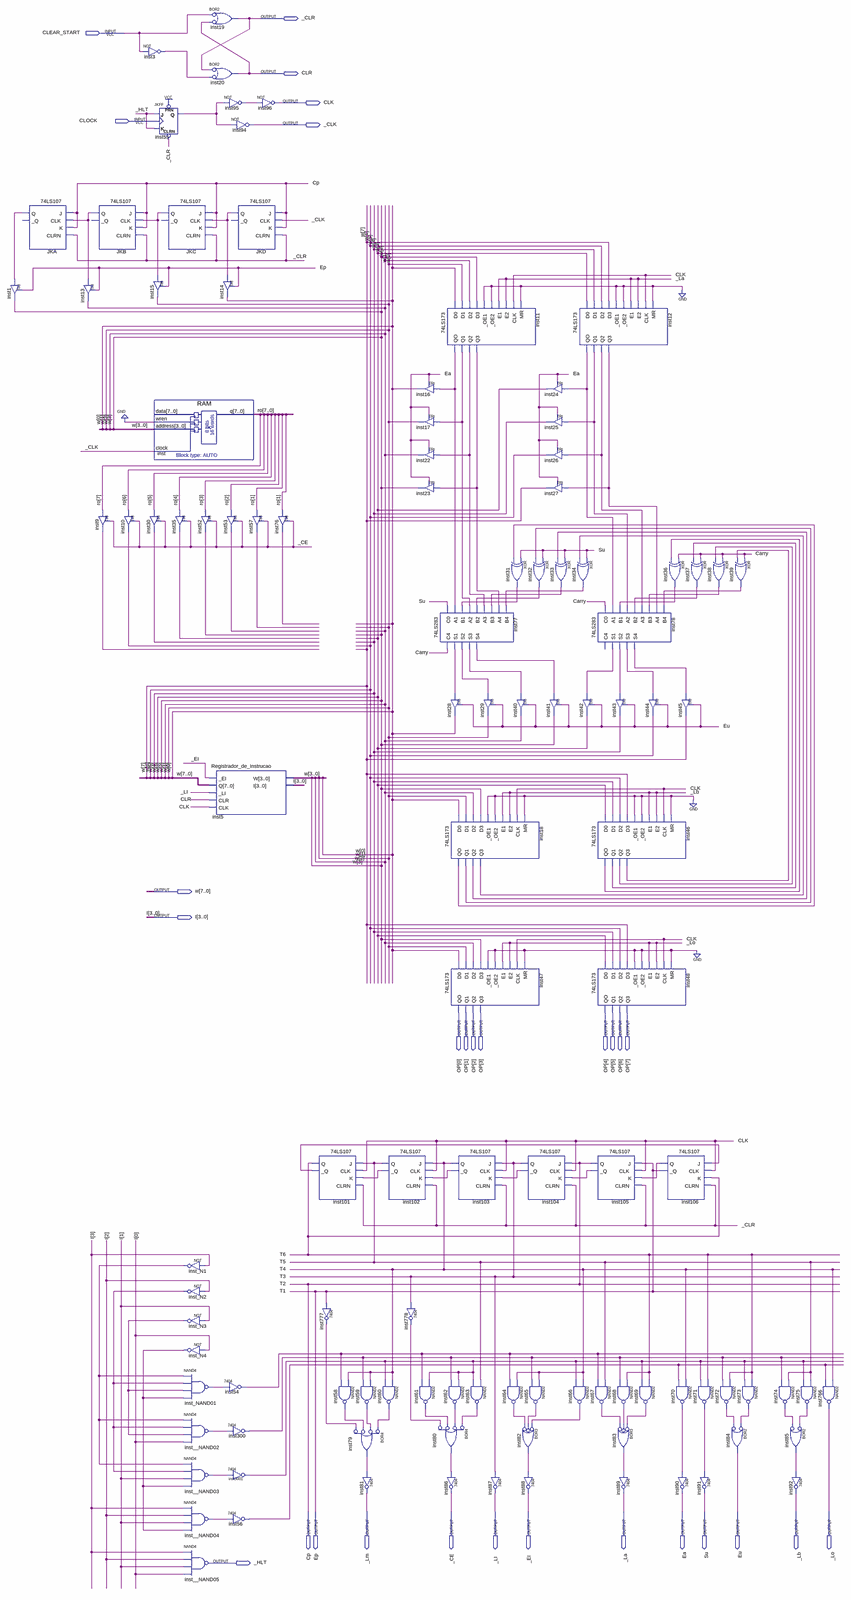
[diagram p0: schematic sheet, whole]
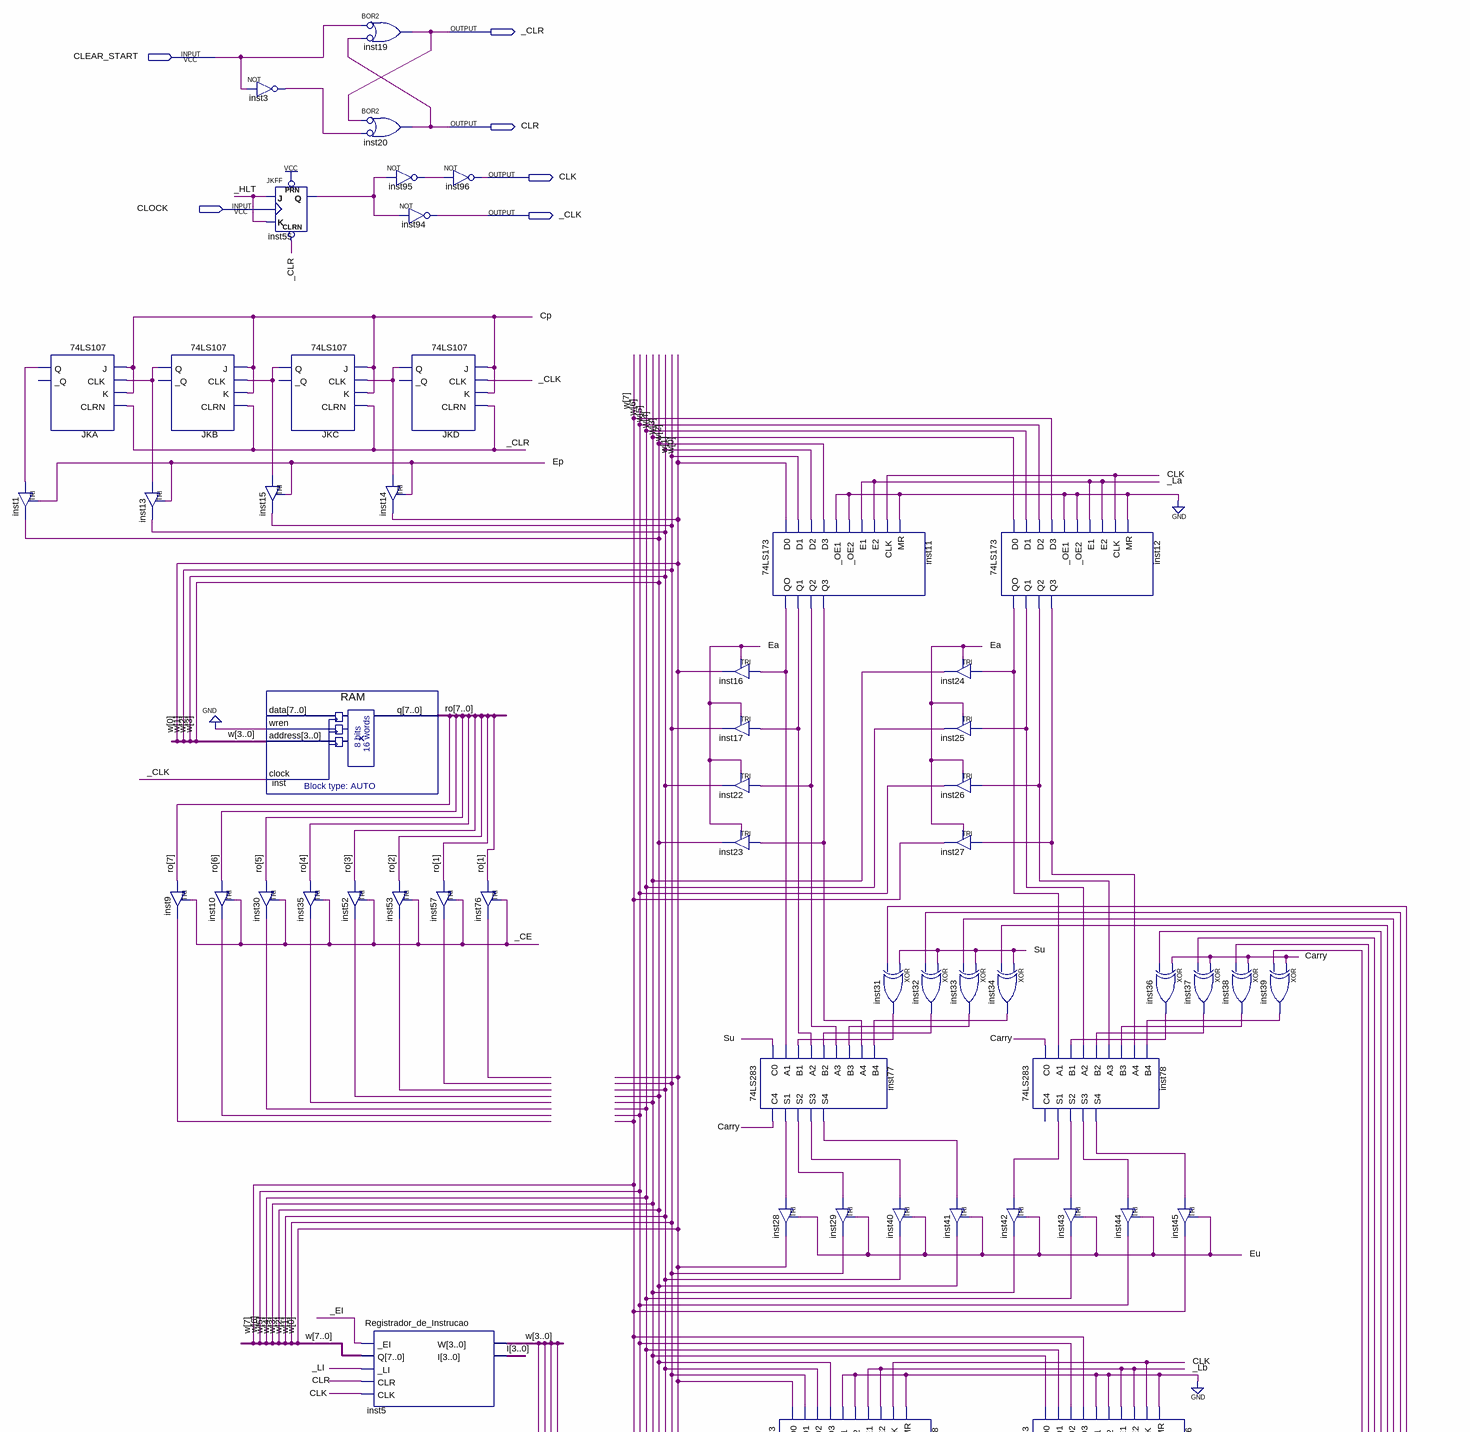
[diagram p1: schematic sheet, upper part]
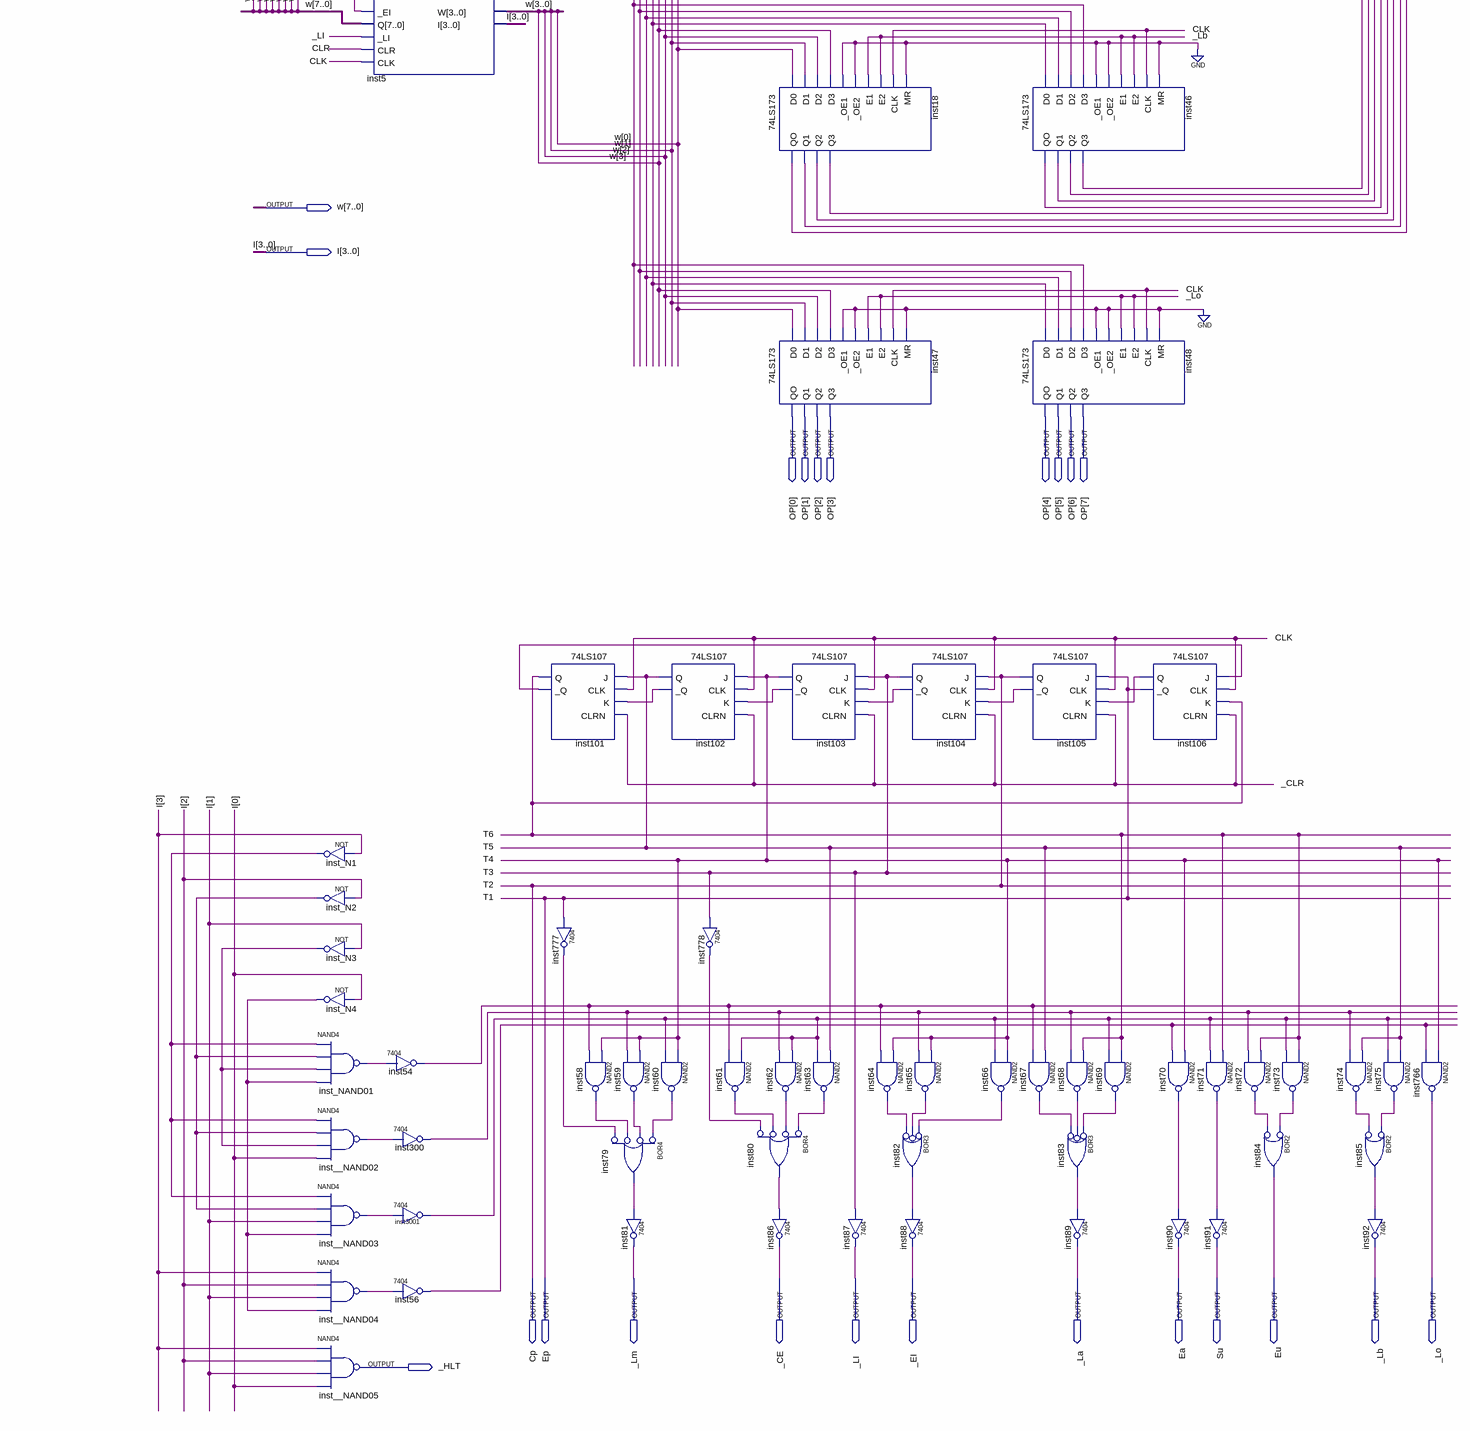
[diagram p2: schematic sheet, lower part]
// Quartus schematic SAP1.bdf as structural Verilog: 111 symbols, 29 pins
module SAP1 (
  input  CLEAR_START,
  input  CLOCK,
  output _CLR,
  output CLR,
  output CLK,
  output _CLK,
  output [7:0] w,
  output [3:0] I,
  output [7:0] OP,
  output Cp,
  output Ep,
  output _Lm,
  output _CE,
  output _LI,
  output _EI,
  output _La,
  output Ea,
  output Su,
  output Eu,
  output _Lb,
  output _Lo,
  output _HLT
);

  wire Carry, inst3_out, inst9_out, inst10_out, inst11_q1, inst11_q2, inst11_q3, inst11_qo, inst12_q1,
       inst12_q2, inst12_q3, inst12_qo, inst18_q1, inst18_q2, inst18_q3, inst18_qo, inst30_out, inst31_out,
       inst32_out, inst33_out, inst34_out, inst35_out, inst36_out, inst37_out, inst38_out, inst39_out,
       inst46_q1, inst46_q2, inst46_q3, inst46_qo, inst52_out, inst53_out, inst54_1, inst55_q, inst56_1,
       inst57_out, inst58_out, inst59_out, inst60_out, inst61_out, inst62_out, inst63_out, inst64_out,
       inst65_out, inst66_out, inst67_out, inst68_out, inst69_out, inst70_out, inst71_out, inst72_out,
       inst73_out, inst74_out, inst75_out, inst76_out, inst77_s1, inst77_s2, inst77_s3, inst77_s4, inst78_s1,
       inst78_s2, inst78_s3, inst78_s4, inst79_out, inst80_out, inst82_out, inst83_out, inst85_out,
       inst95_out, inst101__q, inst102__q, inst103__q, inst104__q, inst105__q, inst106_q, inst300_1,
       inst777_1, inst778_1, inst3001_1, inst__NAND02_out, inst__NAND03_out, inst__NAND04_out, inst_N1_out,
       inst_N2_out, inst_N3_out, inst_N4_out, inst_NAND01_out, JKA_q, JKB_q, JKC_q, JKD_q, T3, T4, T5, T6;
  wire [7:0] ro;

  \74LS107  JKA (.J(Cp), .CLK(JKB_q), .K(Cp), .CLRN(_CLR), .Q(JKA_q));  // open: _Q
  TRI inst1 (.IN(JKA_q), .OE(Ep), .OUT(w[3]));
  \74LS107  JKB (.J(Cp), .CLK(JKC_q), .K(Cp), .CLRN(_CLR), .Q(JKB_q));  // open: _Q
  TRI inst13 (.IN(JKB_q), .OE(Ep), .OUT(w[2]));
  TRI inst9 (.IN(ro[7]), .OE(_CE), .OUT(inst9_out));
  TRI inst10 (.IN(ro[6]), .OE(_CE), .OUT(inst10_out));
  not inst3 (inst3_out, CLEAR_START);
  TRI inst15 (.IN(JKC_q), .OE(Ep), .OUT(w[1]));
  TRI inst30 (.IN(ro[5]), .OE(_CE), .OUT(inst30_out));
  JKFF inst55 (.PRN(1'b1), .CLRN(_CLR), .K(_HLT), .J(_HLT), .CLK(CLOCK), .Q(inst55_q));
  \74LS107  JKC (.J(Cp), .CLK(JKD_q), .K(Cp), .CLRN(_CLR), .Q(JKC_q));  // open: _Q
  RAM inst (.wren(1'b0), .address(w[3:0]), .clock(_CLK), .q(ro));  // open: data
  TRI inst35 (.IN(ro[4]), .OE(_CE), .OUT(inst35_out));
  or inst19 (_CLR, ~CLEAR_START, ~CLR);  // BOR2
  or inst20 (CLR, ~_CLR, ~inst3_out);  // BOR2
  TRI inst52 (.IN(ro[3]), .OE(_CE), .OUT(inst52_out));
  Registrador_de_Instrucao inst5 (._EI(_EI), .Q(w), ._LI(_LI), .CLR(CLR), .CLK(CLK), .W(w[3:0]), .I(I));
  not inst_N1 (inst_N1_out, I[3]);
  not inst_N2 (inst_N2_out, I[2]);
  not inst_N3 (inst_N3_out, I[1]);
  not inst_N4 (inst_N4_out, I[0]);
  nand inst_NAND01 (inst_NAND01_out, inst_N1_out, inst_N2_out, inst_N3_out, inst_N4_out);
  nand inst__NAND02 (inst__NAND02_out, inst_N1_out, inst_N2_out, inst_N3_out, I[0]);
  nand inst__NAND03 (inst__NAND03_out, inst_N1_out, inst_N2_out, I[1], inst_N4_out);
  nand inst__NAND04 (inst__NAND04_out, I[3], I[2], I[1], inst_N4_out);
  nand inst__NAND05 (_HLT, I[3], I[2], I[1], I[0]);
  not inst95 (inst95_out, inst55_q);
  not inst94 (_CLK, inst55_q);
  \74LS107  JKD (.J(Cp), .CLK(_CLK), .K(Cp), .CLRN(_CLR), .Q(JKD_q));  // open: _Q
  TRI inst14 (.IN(JKD_q), .OE(Ep), .OUT(w[0]));
  TRI inst53 (.IN(ro[2]), .OE(_CE), .OUT(inst53_out));
  \7404  inst54 (.\2 (inst_NAND01_out), .\1 (inst54_1));
  \7404  inst300 (.\2 (inst__NAND02_out), .\1 (inst300_1));
  \7404  inst3001 (.\2 (inst__NAND03_out), .\1 (inst3001_1));
  \7404  inst56 (.\2 (inst__NAND04_out), .\1 (inst56_1));
  not inst96 (CLK, inst95_out);
  TRI inst57 (.IN(ro[1]), .OE(_CE), .OUT(inst57_out));
  TRI inst76 (.IN(ro[1]), .OE(_CE), .OUT(inst76_out));
  \74LS107  inst101 (.J(T5), .CLK(CLK), .K(inst102__q), .CLRN(_CLR), .Q(T6), ._Q(inst101__q));
  \7404  inst777 (.\2 (Ep), .\1 (inst777_1));
  nand inst58 (inst58_out, T4, inst54_1);
  nand inst59 (inst59_out, T4, inst300_1);
  or inst79 (inst79_out, ~inst60_out, ~inst59_out, ~inst58_out, ~inst777_1);  // BOR4
  \74LS107  inst102 (.J(T4), .CLK(CLK), .K(inst103__q), .CLRN(_CLR), .Q(T5), ._Q(inst102__q));
  nand inst60 (inst60_out, T4, inst3001_1);
  \7404  inst81 (.\2 (inst79_out), .\1 (_Lm));
  \7404  inst778 (.\2 (T3), .\1 (inst778_1));
  nand inst61 (inst61_out, inst3001_1, inst54_1);
  \74LS173  inst11 (
    .D0(w[0]), .D1(w[1]), .D2(w[2]), .D3(w[3]), ._OE1(1'b0), ._OE2(1'b0), .E1(_La), .E2(_La), .CLK(CLK),
    .MR(1'b0), .QO(inst11_qo), .Q1(inst11_q1), .Q2(inst11_q2), .Q3(inst11_q3));
  TRI inst16 (.IN(inst11_qo), .OE(Ea), .OUT(w[0]));
  TRI inst17 (.IN(inst11_q1), .OE(Ea), .OUT(w[1]));
  TRI inst22 (.IN(inst11_q2), .OE(Ea), .OUT(w[2]));
  TRI inst23 (.IN(inst11_q3), .OE(Ea), .OUT(w[3]));
  \74LS283  inst77 (
    .C0(Su), .A1(inst11_qo), .B1(inst31_out), .A2(inst11_q1), .B2(inst32_out), .A3(inst11_q2),
    .B3(inst33_out), .A4(inst11_q3), .B4(inst34_out), .C4(Carry), .S1(inst77_s1), .S2(inst77_s2),
    .S3(inst77_s3), .S4(inst77_s4));
  \74LS173  inst18 (
    .D0(w[0]), .D1(w[1]), .D2(w[2]), .D3(w[3]), ._OE1(1'b0), ._OE2(1'b0), .E1(_Lb), .E2(_Lb), .CLK(CLK),
    .MR(1'b0), .QO(inst18_qo), .Q1(inst18_q1), .Q2(inst18_q2), .Q3(inst18_q3));
  \74LS173  inst47 (
    .D0(w[0]), .D1(w[1]), .D2(w[2]), .D3(w[3]), ._OE1(1'b0), ._OE2(1'b0), .E1(_Lo), .E2(_Lo), .CLK(CLK),
    .MR(1'b0), .QO(OP[0]), .Q1(OP[1]), .Q2(OP[2]), .Q3(OP[3]));
  nand inst62 (inst62_out, inst3001_1, inst300_1);
  or inst80 (inst80_out, ~inst63_out, ~inst62_out, ~inst61_out, ~inst778_1);  // BOR4
  \7404  inst86 (.\2 (inst80_out), .\1 (_CE));
  TRI inst28 (.IN(inst77_s1), .OE(Eu), .OUT(w[0]));
  \74LS107  inst103 (.J(T3), .CLK(CLK), .K(inst104__q), .CLRN(_CLR), .Q(T4), ._Q(inst103__q));
  nand inst63 (inst63_out, T5, inst3001_1);
  TRI inst29 (.IN(inst77_s2), .OE(Eu), .OUT(w[1]));
  nand inst64 (inst64_out, T4, inst54_1);
  \7404  inst87 (.\2 (T3), .\1 (_LI));
  xor inst31 (inst31_out, Su, inst18_qo);
  xor inst32 (inst32_out, Su, inst18_q1);
  TRI inst40 (.IN(inst77_s3), .OE(Eu), .OUT(w[2]));
  \74LS107  inst104 (.J(Cp), .CLK(CLK), .K(inst105__q), .CLRN(_CLR), .Q(T3), ._Q(inst104__q));
  nand inst65 (inst65_out, T4, inst300_1);
  or inst82 (inst82_out, ~inst66_out, ~inst65_out, ~inst64_out);  // BOR3
  \7404  inst88 (.\2 (inst82_out), .\1 (_EI));
  TRI inst24 (.IN(inst12_qo), .OE(Ea), .OUT(w[4]));
  TRI inst25 (.IN(inst12_q1), .OE(Ea), .OUT(w[5]));
  TRI inst26 (.IN(inst12_q2), .OE(Ea), .OUT(w[6]));
  TRI inst27 (.IN(inst12_q3), .OE(Ea), .OUT(w[7]));
  xor inst33 (inst33_out, Su, inst18_q2);
  TRI inst41 (.IN(inst77_s4), .OE(Eu), .OUT(w[3]));
  \74LS173  inst12 (
    .D0(w[4]), .D1(w[5]), .D2(w[6]), .D3(w[7]), ._OE1(1'b0), ._OE2(1'b0), .E1(_La), .E2(_La), .CLK(CLK),
    .MR(1'b0), .QO(inst12_qo), .Q1(inst12_q1), .Q2(inst12_q2), .Q3(inst12_q3));
  xor inst34 (inst34_out, Su, inst18_q3);
  \74LS283  inst78 (
    .C0(Carry), .A1(inst12_qo), .B1(inst36_out), .A2(inst12_q1), .B2(inst37_out), .A3(inst12_q2),
    .B3(inst38_out), .A4(inst12_q3), .B4(inst39_out), .S1(inst78_s1), .S2(inst78_s2), .S3(inst78_s3),
    .S4(inst78_s4));  // open: C4
  TRI inst42 (.IN(inst78_s1), .OE(Eu), .OUT(w[4]));
  \74LS173  inst46 (
    .D0(w[4]), .D1(w[5]), .D2(w[6]), .D3(w[7]), ._OE1(1'b0), ._OE2(1'b0), .E1(_Lb), .E2(_Lb), .CLK(CLK),
    .MR(1'b0), .QO(inst46_qo), .Q1(inst46_q1), .Q2(inst46_q2), .Q3(inst46_q3));
  \74LS173  inst48 (
    .D0(w[4]), .D1(w[5]), .D2(w[6]), .D3(w[7]), ._OE1(1'b0), ._OE2(1'b0), .E1(_Lo), .E2(_Lo), .CLK(CLK),
    .MR(1'b0), .QO(OP[4]), .Q1(OP[5]), .Q2(OP[6]), .Q3(OP[7]));
  \74LS107  inst105 (.J(Ep), .CLK(CLK), .K(inst106_q), .CLRN(_CLR), .Q(Cp), ._Q(inst105__q));
  nand inst66 (inst66_out, T4, inst3001_1);
  nand inst67 (inst67_out, T5, inst54_1);
  TRI inst43 (.IN(inst78_s2), .OE(Eu), .OUT(w[5]));
  nand inst68 (inst68_out, T6, inst300_1);
  or inst83 (inst83_out, ~inst69_out, ~inst68_out, ~inst67_out);  // BOR3
  \7404  inst89 (.\2 (inst83_out), .\1 (_La));
  TRI inst44 (.IN(inst78_s3), .OE(Eu), .OUT(w[6]));
  nand inst69 (inst69_out, T6, inst3001_1);
  xor inst36 (inst36_out, Carry, inst46_qo);
  TRI inst45 (.IN(inst78_s4), .OE(Eu), .OUT(w[7]));
  \74LS107  inst106 (.J(inst101__q), .CLK(CLK), .K(T6), .CLRN(_CLR), .Q(inst106_q), ._Q(Ep));
  nand inst70 (inst70_out, T4, inst56_1);
  \7404  inst90 (.\2 (inst70_out), .\1 (Ea));
  xor inst37 (inst37_out, Carry, inst46_q1);
  xor inst38 (inst38_out, Carry, inst46_q2);
  nand inst71 (inst71_out, T6, inst3001_1);
  \7404  inst91 (.\2 (inst71_out), .\1 (Su));
  xor inst39 (inst39_out, Carry, inst46_q3);
  nand inst72 (inst72_out, T6, inst300_1);
  nand inst73 (inst73_out, T6, inst3001_1);
  or inst84 (Eu, ~inst73_out, ~inst72_out);  // BOR2
  nand inst74 (inst74_out, T5, inst300_1);
  nand inst75 (inst75_out, T5, inst3001_1);
  or inst85 (inst85_out, ~inst75_out, ~inst74_out);  // BOR2
  \7404  inst92 (.\2 (inst85_out), .\1 (_Lb));
  nand inst766 (_Lo, T4, inst56_1);

  // Other names for the same wires on the sheet: T1 = Ep; T2 = Cp
endmodule
